# Altium schematic sheet 09-DPLL-3.SchDoc
size B; SheetNumber: 9; SheetTotal: 20
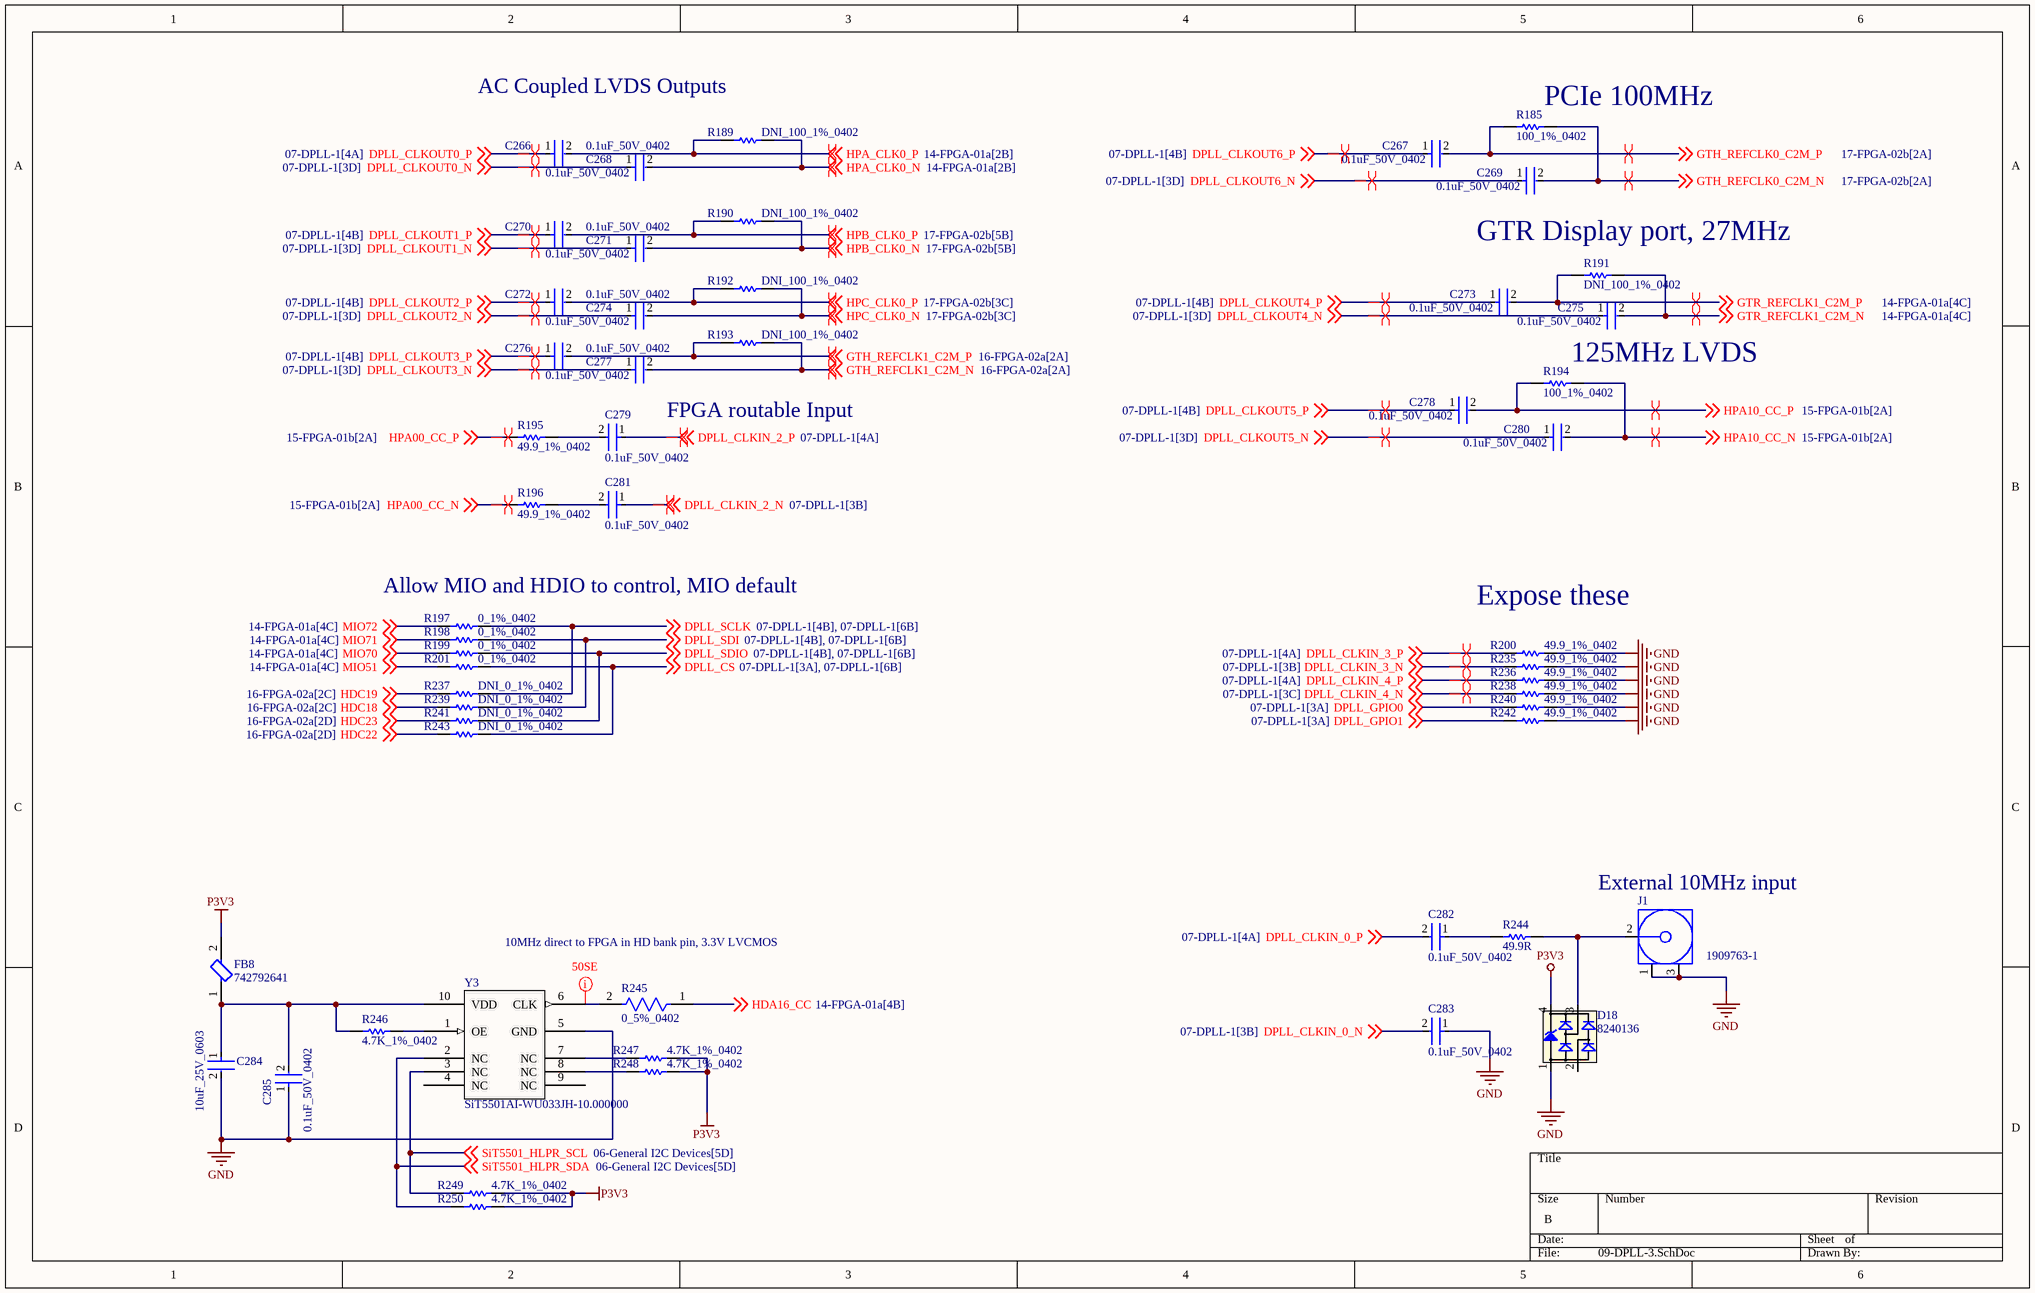
[diagram p0: 09-DPLL-3.SchDoc]

## Parts
C266  0.1uF_50V_0402  [FP-C1005-050-0_05-IPC_C]
C267  0.1uF_50V_0402  [FP-C1005-050-0_05-IPC_C]
C268  0.1uF_50V_0402  [FP-C1005-050-0_05-IPC_C]
C269  0.1uF_50V_0402  [FP-C1005-050-0_05-IPC_C]
C270  0.1uF_50V_0402  [FP-C1005-050-0_05-IPC_C]
C271  0.1uF_50V_0402  [FP-C1005-050-0_05-IPC_C]
C272  0.1uF_50V_0402  [FP-C1005-050-0_05-IPC_C]
C273  0.1uF_50V_0402  [FP-C1005-050-0_05-IPC_C]
C274  0.1uF_50V_0402  [FP-C1005-050-0_05-IPC_C]
C275  0.1uF_50V_0402  [FP-C1005-050-0_05-IPC_C]
C276  0.1uF_50V_0402  [FP-C1005-050-0_05-IPC_C]
C277  0.1uF_50V_0402  [FP-C1005-050-0_05-IPC_C]
C278  0.1uF_50V_0402  [FP-C1005-050-0_05-IPC_C]
C279  0.1uF_50V_0402  [FP-C1005-050-0_05-IPC_C]
C280  0.1uF_50V_0402  [FP-C1005-050-0_05-IPC_C]
C281  0.1uF_50V_0402  [FP-C1005-050-0_05-IPC_C]
C282  0.1uF_50V_0402  [FP-C1005-050-0_05-IPC_C]
C283  0.1uF_50V_0402  [FP-C1005-050-0_05-IPC_C]
C284  10uF_25V_0603  [FP-CL10-IPC_C]
C285  0.1uF_50V_0402  [FP-C1005-050-0_05-IPC_C]
D18  8240136  [SOT143-4L]
FB8  742792641  [FP-742792641-MFG]
J1  1909763-1  [TECO-1909763-1_V]
R185  100_1%_0402  [RESC1005X40X25ML05T10]
R189  DNI_100_1%_0402  [RESC1005X40X25LL05T05]  (no BOM)
R190  DNI_100_1%_0402  [RESC1005X40X25LL05T05]  (no BOM)
R191  DNI_100_1%_0402  [RESC1005X40X25ML05T10]  (no BOM)
R192  DNI_100_1%_0402  [RESC1005X40X25LL05T05]  (no BOM)
R193  DNI_100_1%_0402  [RESC1005X40X25LL05T05]
R194  100_1%_0402  [RESC1005X40X25ML05T10]
R195  49.9_1%_0402  [RESC1005X40X25NL10T10]
R196  49.9_1%_0402  [RESC1005X40X25NL10T10]
R197  0_1%_0402  [RESC1005X40X25LL05T05]
R198  0_1%_0402  [RESC1005X40X25LL05T05]
R199  0_1%_0402  [RESC1005X40X25LL05T05]
R200  49.9_1%_0402  [RESC1005X40X25NL10T10]
R201  0_1%_0402  [RESC1005X40X25LL05T05]
R235  49.9_1%_0402  [RESC1005X40X25NL10T10]
R236  49.9_1%_0402  [RESC1005X40X25NL10T10]
R237  DNI_0_1%_0402  [RESC1005X40X25LL05T05]  (no BOM)
R238  49.9_1%_0402  [RESC1005X40X25NL10T10]
R239  DNI_0_1%_0402  [RESC1005X40X25LL05T05]  (no BOM)
R240  49.9_1%_0402  [RESC1005X40X25NL10T10]
R241  DNI_0_1%_0402  [RESC1005X40X25LL05T05]  (no BOM)
R242  49.9_1%_0402  [RESC1005X40X25NL10T10]
R243  DNI_0_1%_0402  [RESC1005X40X25LL05T05]  (no BOM)
R244  49.9R  [RESC1608X55X25NL10T15]
R245  0_5%_0402  [FP-AC0402-0_37-IPC_B]
R246  4.7K_1%_0402  [RESC1005X40X25NL10T10]
R247  4.7K_1%_0402  [RESC1005X40X25NL10T10]
R248  4.7K_1%_0402  [RESC1005X40X25NL10T10]
R249  4.7K_1%_0402  [RESC1005X40X25NL10T10]
R250  4.7K_1%_0402  [RESC1005X40X25NL10T10]
Y3  Manufacturer Part Number: SiT5501AI-WU033JH-10.000000  [SITIME_SPL-086-CQFN-010-C07050_REV_DRAFT]  (hidden comment: SiTime_SiT5501AC-WU-33E0-10T)

## Nets
GND: C283.1 C284.2 C285.1 D18.1(GND) J1.1 J1.3 R200.2 R235.2 R236.2 R238.2 R240.2 R242.2 Y3.5(GND)
P3V3: D18.4(VDD) FB8.2 R247.2 R248.2 R249.2 R250.2
DPLL_CLKIN_0_N: C283.2 ; off-sheet DPLL_CLKIN_0_N
DPLL_CLKIN_0_P: C282.2 ; off-sheet DPLL_CLKIN_0_P
DPLL_CLKIN_2_N: C281.1 ; off-sheet DPLL_CLKIN_2_N
DPLL_CLKIN_2_P: C279.1 ; off-sheet DPLL_CLKIN_2_P
DPLL_CLKIN_3_N: R235.1 ; off-sheet DPLL_CLKIN_3_N
DPLL_CLKIN_3_P: R200.1 ; off-sheet DPLL_CLKIN_3_P
DPLL_CLKIN_4_N: R238.1 ; off-sheet DPLL_CLKIN_4_N
DPLL_CLKIN_4_P: R236.1 ; off-sheet DPLL_CLKIN_4_P
DPLL_CLKOUT0_N: C268.1 ; off-sheet DPLL_CLKOUT0_N
DPLL_CLKOUT0_P: C266.1 ; off-sheet DPLL_CLKOUT0_P
DPLL_CLKOUT1_N: C271.1 ; off-sheet DPLL_CLKOUT1_N
DPLL_CLKOUT1_P: C270.1 ; off-sheet DPLL_CLKOUT1_P
DPLL_CLKOUT2_N: C274.1 ; off-sheet DPLL_CLKOUT2_N
DPLL_CLKOUT2_P: C272.1 ; off-sheet DPLL_CLKOUT2_P
DPLL_CLKOUT3_N: C277.1 ; off-sheet DPLL_CLKOUT3_N
DPLL_CLKOUT3_P: C276.1 ; off-sheet DPLL_CLKOUT3_P
DPLL_CLKOUT4_N: C275.1 ; off-sheet DPLL_CLKOUT4_N
DPLL_CLKOUT4_P: C273.1 ; off-sheet DPLL_CLKOUT4_P
DPLL_CLKOUT5_N: C280.1 ; off-sheet DPLL_CLKOUT5_N
DPLL_CLKOUT5_P: C278.1 ; off-sheet DPLL_CLKOUT5_P
DPLL_CLKOUT6_N: C269.1 ; off-sheet DPLL_CLKOUT6_N
DPLL_CLKOUT6_P: C267.1 ; off-sheet DPLL_CLKOUT6_P
DPLL_CS: R201.2 R243.2 ; off-sheet DPLL_CS
DPLL_GPIO0: R240.1 ; off-sheet DPLL_GPIO0
DPLL_GPIO1: R242.1 ; off-sheet DPLL_GPIO1
DPLL_SCLK: R197.2 R237.2 ; off-sheet DPLL_SCLK
DPLL_SDI: R198.2 R239.2 ; off-sheet DPLL_SDI
DPLL_SDIO: R199.2 R241.2 ; off-sheet DPLL_SDIO
GTH_REFCLK0_C2M_N: C269.2 R185.2 ; off-sheet GTH_REFCLK0_C2M_N
GTH_REFCLK0_C2M_P: C267.2 R185.1 ; off-sheet GTH_REFCLK0_C2M_P
GTH_REFCLK1_C2M_N: C277.2 R193.2 ; off-sheet GTH_REFCLK1_C2M_N
GTH_REFCLK1_C2M_P: C276.2 R193.1 ; off-sheet GTH_REFCLK1_C2M_P
GTR_REFCLK1_C2M_N: C275.2 R191.2 ; off-sheet GTR_REFCLK1_C2M_N
GTR_REFCLK1_C2M_P: C273.2 R191.1 ; off-sheet GTR_REFCLK1_C2M_P
HDA16_CC: R245.1 ; off-sheet HDA16_CC
HDC18: R239.1 ; off-sheet HDC18
HDC19: R237.1 ; off-sheet HDC19
HDC22: R243.1 ; off-sheet HDC22
HDC23: R241.1 ; off-sheet HDC23
HPA00_CC_N: R196.1 ; off-sheet HPA00_CC_N
HPA00_CC_P: R195.1 ; off-sheet HPA00_CC_P
HPA10_CC_N: C280.2 R194.2 ; off-sheet HPA10_CC_N
HPA10_CC_P: C278.2 R194.1 ; off-sheet HPA10_CC_P
HPA_CLK0_N: C268.2 R189.2 ; off-sheet HPA_CLK0_N
HPA_CLK0_P: C266.2 R189.1 ; off-sheet HPA_CLK0_P
HPB_CLK0_N: C271.2 R190.2 ; off-sheet HPB_CLK0_N
HPB_CLK0_P: C270.2 R190.1 ; off-sheet HPB_CLK0_P
HPC_CLK0_N: C274.2 R192.2 ; off-sheet HPC_CLK0_N
HPC_CLK0_P: C272.2 R192.1 ; off-sheet HPC_CLK0_P
MIO51: R201.1 ; off-sheet MIO51
MIO70: R199.1 ; off-sheet MIO70
MIO71: R198.1 ; off-sheet MIO71
MIO72: R197.1 ; off-sheet MIO72
SiT5501_HLPR_SCL: R249.1 Y3.3(NC) ; off-sheet SiT5501_HLPR_SCL
SiT5501_HLPR_SDA: R250.1 Y3.2(NC) ; off-sheet SiT5501_HLPR_SDA
NetC279_2: C279.2 R195.2
NetC281_2: C281.2 R196.2
NetC282_1: C282.1 R244.1
NetC284_1: C284.1 C285.2 FB8.1 R246.2 Y3.10(VDD)
NetD18_3: D18.3(I/O2) J1.2 R244.2
NetR245_2: R245.2 Y3.6(CLK)
NetR246_1: R246.1 Y3.1(OE)
NetR247_1: R247.1 Y3.7(NC)
NetR248_1: R248.1 Y3.8(NC)

Not connected (* = marked no-connect by the designer): D18 2(I/O1); Y3 4(NC) 9(NC)

## Layout directives
differential pair: DPLL_CLKIN_2_N, DPLL_CLKIN_2_P, DPLL_CLKIN_3_N, DPLL_CLKIN_3_P, DPLL_CLKIN_4_N, DPLL_CLKIN_4_P, DPLL_CLKOUT0_N, DPLL_CLKOUT0_P, DPLL_CLKOUT1_N, DPLL_CLKOUT1_P, DPLL_CLKOUT2_N, DPLL_CLKOUT2_P, DPLL_CLKOUT3_N, DPLL_CLKOUT3_P, DPLL_CLKOUT4_N, DPLL_CLKOUT4_P, DPLL_CLKOUT5_N, DPLL_CLKOUT5_P, DPLL_CLKOUT6_N, DPLL_CLKOUT6_P, GTH_REFCLK0_C2M_N, GTH_REFCLK0_C2M_P, GTH_REFCLK1_C2M_N, GTH_REFCLK1_C2M_P, GTR_REFCLK1_C2M_N, GTR_REFCLK1_C2M_P, HPA00_CC_N, HPA00_CC_P, HPA10_CC_N, HPA10_CC_P, HPA_CLK0_N, HPA_CLK0_P, HPB_CLK0_N, HPB_CLK0_P, HPC_CLK0_N, HPC_CLK0_P
net class 50SE: NetR245_2

## Notes on the sheet
- AC Coupled LVDS Outputs
- (near R185) PCIe 100MHz
- GTR Display port, 27MHz
- 125MHz LVDS
- FPGA routable Input
- Allow MIO and HDIO to control, MIO default
- Expose these
- (near J1) External 10MHz input
- 10MHz direct to FPGA in HD bank pin, 3.3V LVCMOS

## Library data of the parts
C266-C283 C285 = CMP-2000-05393-2: Multilayer Ceramic Capacitors 100nF ±10% 50V X7R SMD 0402; Voltage: 50V; Dielectric Material: Ceramic; Min Operating Temperature: -55°C; Depth: 0.5mm; Radiation Hardening: No; RoHS Compliant: Yes; Voltage Rating (DC): 50V; Lead Free: Lead Free; Resistor Type: Ceramic; Height: 0.5mm; Dielectric: X7R; Thickness: 0.022inch; Case/Package: 0402; Case Code (Metric): 1005; Termination: SMD/SMT; Capacitance: 100nF; Packaging: Tape and Reel; Max Operating Temperature: 125°C; Mount: Surface Mount; Package Quantity: 1; Width: 0.02inch; Weight: 2.3E-05oz; Voltage Rating: 50V; Tolerance: 10%; Construction: Flat; Case Code (Imperial): 0402; Length: 1mm; REACH SVHC: No SVHC; Series: C
C284 = CMP-13271-004224-1: Cap Ceramic 10uF 25V X5R ±20% Pad SMD 0603 +85°C T/R; Width: 0.031inch; Voltage Rating: 25V; Length: 0.063inch; Case Code (Metric): 1608; Dielectric: X5R; Termination: Wraparound; Capacitance: 10uF; Lead Free: Lead Free; Mount: Surface Mount; Package Quantity: 1; Case Code (Imperial): 0603; Thickness: 0.035inch; Packaging: Tape and Reel; Contact Plating: Tin; Min Operating Temperature: -55°C; Tolerance: 20%; Max Operating Temperature: 85°C; Case/Package: 0603
D18 = CMP-1486-00002-1: TVS Diode WE-TVS-HS, VRWM=3.3V; Manufacturer: Wuerth Elektronik; Reverse Stand Off Voltage: 3.3V; PartNumber: 8240136; ComponentLink1Description: Manufacturer URL; PackageReference: SOT143-4L; ComponentLink1URL: http://www.we-online.com; ComponentLink2Description: Datasheet; ComponentLink2URL: http://katalog.we-online.de/kataloge/eisos/media/pdf/8240136.pdf
FB8 = CMP-0220-00171-2: FERRITE BEAD 300 OHM 0603 1LN; Inductance: 18nH; Max DC Current: 2A; Number of Lines: 1; Test Frequency: 100MHz; Impedance: 300R; DC Resistance (DCR): 150mR; Tolerance: 25%; Case Code (Metric): 1608; Core Material: Ferrite; Length: 1.6mm; Lead Free: Lead Free; Series: WE-CBF; Min Operating Temperature: -55°C; RoHS Compliant: Yes; Case/Package: SMD/SMT; Material: Ferrite; Max Operating Temperature: 125°C; Termination: SMD/SMT; Packaging: Tape and Reel; Weight: 0.000141oz; Case Code (Imperial): 0603; Width: 0.8mm; Mount: Surface Mount; Max Current Rating: 2A; Package Quantity: 1; Depth: 0.8mm; Current Rating: 2A; Height: 0.8mm
J1 = CMP-2000-07505-1: Ultra Miniature Coaxial Connector Jack, 60 V, 50 Ohm, -40 to 90 degC, RoHS, Tape and Reel; Manufacturer: TE Connectivity; Gender: Female; PCB Mounting Orientation: Vertical; Body Material: LiquidCrystalPolymer; Case\/Package: SMD/SMT; Impedance: 50Ohm; Max Frequency: 6GHz; Body Plating: Gold; Dielectric Material: Polymer; Orientation: Straight; Mount: SurfaceMount; Length: 3mm; Packaging: TapeandReel; Connector Type: Jack; Lead Free: LeadFree; Package Quantity: 1; Termination: SMD/SMT; Contact Material: CopperAlloy; Fastening Type: Pull; RoHSCompliant: true; Max Operating Temperature: 90degC; Datasheet URL: http://www.te.com/commerce/DocumentDelivery/DDEController?Action=srchrtrv&DocNm=1909763&DocType=Customer+Drawing&DocLang=English; Contact Plating: Gold; Mounting Technology: SurfaceMount; Package Reference: TECO-1909763-1; Insulation Material: Thermoplastic; Min Operating Temperature: -40degC; Manufacturer URL: http://www.te.com/; ELV: Compliant; Datasheet Version: Rev. B2, 11/2015; Radiation Hardening: No; Package Description: 3-Pin Surface Mount Device, Body 2.6 x 2.6 mm; Housing Colour: Beige
R185 R191 R194 = CMP-2002-06458-1: Part Number: ERJ-U02F1000X; Manufacturer: Panasonic
R189 R190 R192 R193 = CMP-2002-00605-3: Chip Resistor, 100 Ohm, +/- 1%, 100 mW, -55 to 155 degC, 0402 (1005 Metric), RoHS, Tape and Reel; Manufacturer: Basic Passives; PartNumber: ERJ-2RKF1000X; Power Rating: 100 mW; Resistance: 100 Ohm; Voltage Rating: 50 V; Case\/Package: 0402; Width: 0.5 mm; Pins: 2; ComponentLink2Description: Datasheet; PackageReference: 0402; Height: 0.35 mm; Tolerance: 1%; DatasheetVersion: 04/2015; Case Code (Imperial): 0402; Min Operating Temperature: -55 degC; Radiation Hardening: No; Length: 1 mm; Package Quantity: 10000; PackageDescription: 2-Pin Surface Mount Device, Body 1 x 0.5 mm; Mounting Technology: Surface Mount; Case Code (Metric): 1005; Packaging: Tape and Reel; ComponentLink1URL: http://www.panasonic.com/; RoHSCompliant: true; Max Operating Temperature: 155 degC; REACH SVHC: Yes; ComponentLink1Description: Manufacturer URL; ComponentLink2URL: http://industrial.panasonic.com/cdbs/www-data/pdf/RDA0000/AOA0000C86.pdf; Mount: Surface Mount
R195 R196 R200 R235 R236 R238 R240 R242 = CMP-2002-04448-1: Part Number: RK73H1ETTP49R9F; Manufacturer: KOA Speer
R197-R199 R201 R237 R239 R241 R243 = CMP-2000-07451-1: Chip Resistor, 0 Ohm, 0.1 W, -55 to 155 degC, 0402 (1005 Metric), RoHS, Tape and Reel; Manufacturer: Panasonic; Voltage Rating (DC): 50V; Temperature Coefficient: 600ppm/��C; Max Power Dissipation: 100mW; Resistance: 0mOhm; Tolerance: 5%; Number of Terminations: 2; Mount: SurfaceMount; Height: 0.35mm; Packaging: TapeandReel; Contact Plating: Tin; Manufacturer URL: http://www.panasonic.com/; Composition: ThickFilm; Max Operating Temperature: 155degC; REACH SVHC: NoSVHC; Case/Package: 0402; Package Reference: 402; Depth: 0.5mm; Package Description: 2-Pin Surface Mount Device, Body 1 x 0.5 mm; Datasheet URL: https://industrial.panasonic.com/cdbs/www-data/pdf/RDA0000/AOA0000C301.pdf; RoHSCompliant: True; Case Code (Imperial): 0402; Military Standard: Not; Min Operating Temperature: -55degC; Power Rating: 100mW; Datasheet Version: 03/2015; Length: 1mm; Case Code (Metric): 1005; Termination: SMD/SMT; Mounting Technology: SurfaceMount; Voltage Rating: 50V; Width: 0.02inch; Package Quantity: 1; Lead Free: LeadFree; Radiation Hardening: No
R244 = CMP-1659-00036-1: General Purpose Chip Resistor, 49.9 Ohm, +/- 1%, -55 to 155 degC, 0603 (1608 Metric), RoHS, Tape and Reel; Max Supply Voltage: 3.63 V; Case\Package: LQFP; Interface: SPI; Min Supply Voltage: 2.97 V; PackageReference: 0603; Packaging: Tray; ComponentLink2Description: Datasheet; ComponentLink1Description: Manufacturer URL; ComponentLink2URL: https://datasheet.ciiva.com/11808/0900766b80f96399-11808223.pdf; RoHSCompliant: true; Max Operating Temperature: 85 degC; ComponentLink1URL: http://www.yageo.com/; PackageDescription: 2-Pin Surface Mount Device, Body 1.6 x 0.8 mm; DatasheetVersion: Rev. 4, 04/2009; Min Operating Temperature: -40 degC; Package Quantity: 250; Pins: 48
R245 = CMP-2002-01772-2: RESISTOR 0402 JUMPER ZERO OHM; Voltage Rating: 50V; Temperature Coefficient: 200ppm/°C; Tolerance: 1%; Power Rating: 62.5mW; Resistance: 0R; Min Operating Temperature: -55°C; Termination: SMD/SMT; Case/Package: 0402; Case Code (Imperial): 0402; Packaging: Tape and Reel; Case Code (Metric): 1005; Max Operating Temperature: 155°C; Series: AC
R246-R250 = CMP-2002-05217-1: Manufacturer: Bourns; Part Number: CR0402-FX-4701GLF
Y3 = CMP-OSC-00029-2: OSC, MEMS, STRATUM 3E, 10.000MHZ, 10PPB STAB, LVCMOS, 3.3V, O/P EN, 7.0X5.0X2.2MM, CQFN-10; Manufacturer: SiTime; Frequency: 10 MHz; Voltage - Supply: 3.3 V; Type: OCXO; Category: Oscillators; Max Operating Temperature: 70°C; Min Operating Temperature: -20°C; Height: 2.20mm (max); Case/Package: 10 Lead QFN; Output: LVCMOS; Mounting Type: Surface Mount; Frequency Stability: ±10 ppb; RoHS: Yes